# EAGLE schematic DP_current_measure_v1 (EAGLE 9.4.2)
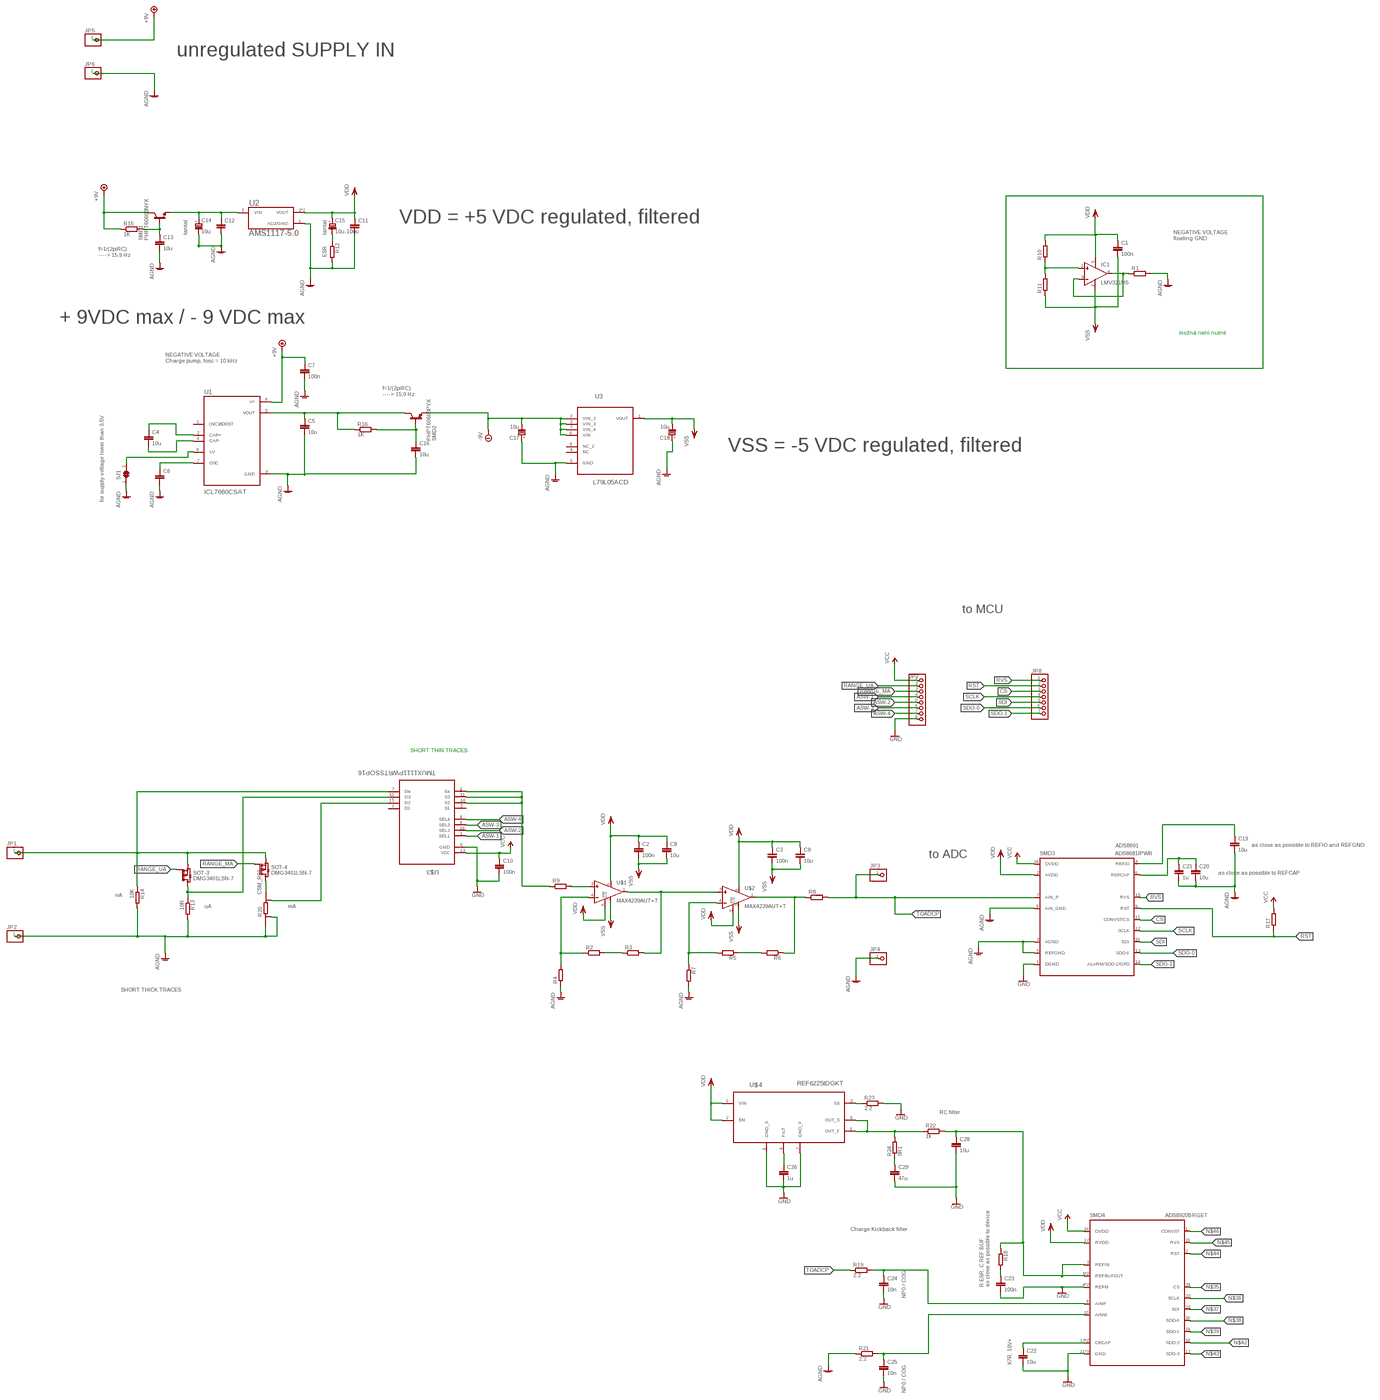
[diagram p0: schematic, sheet 1, overview]
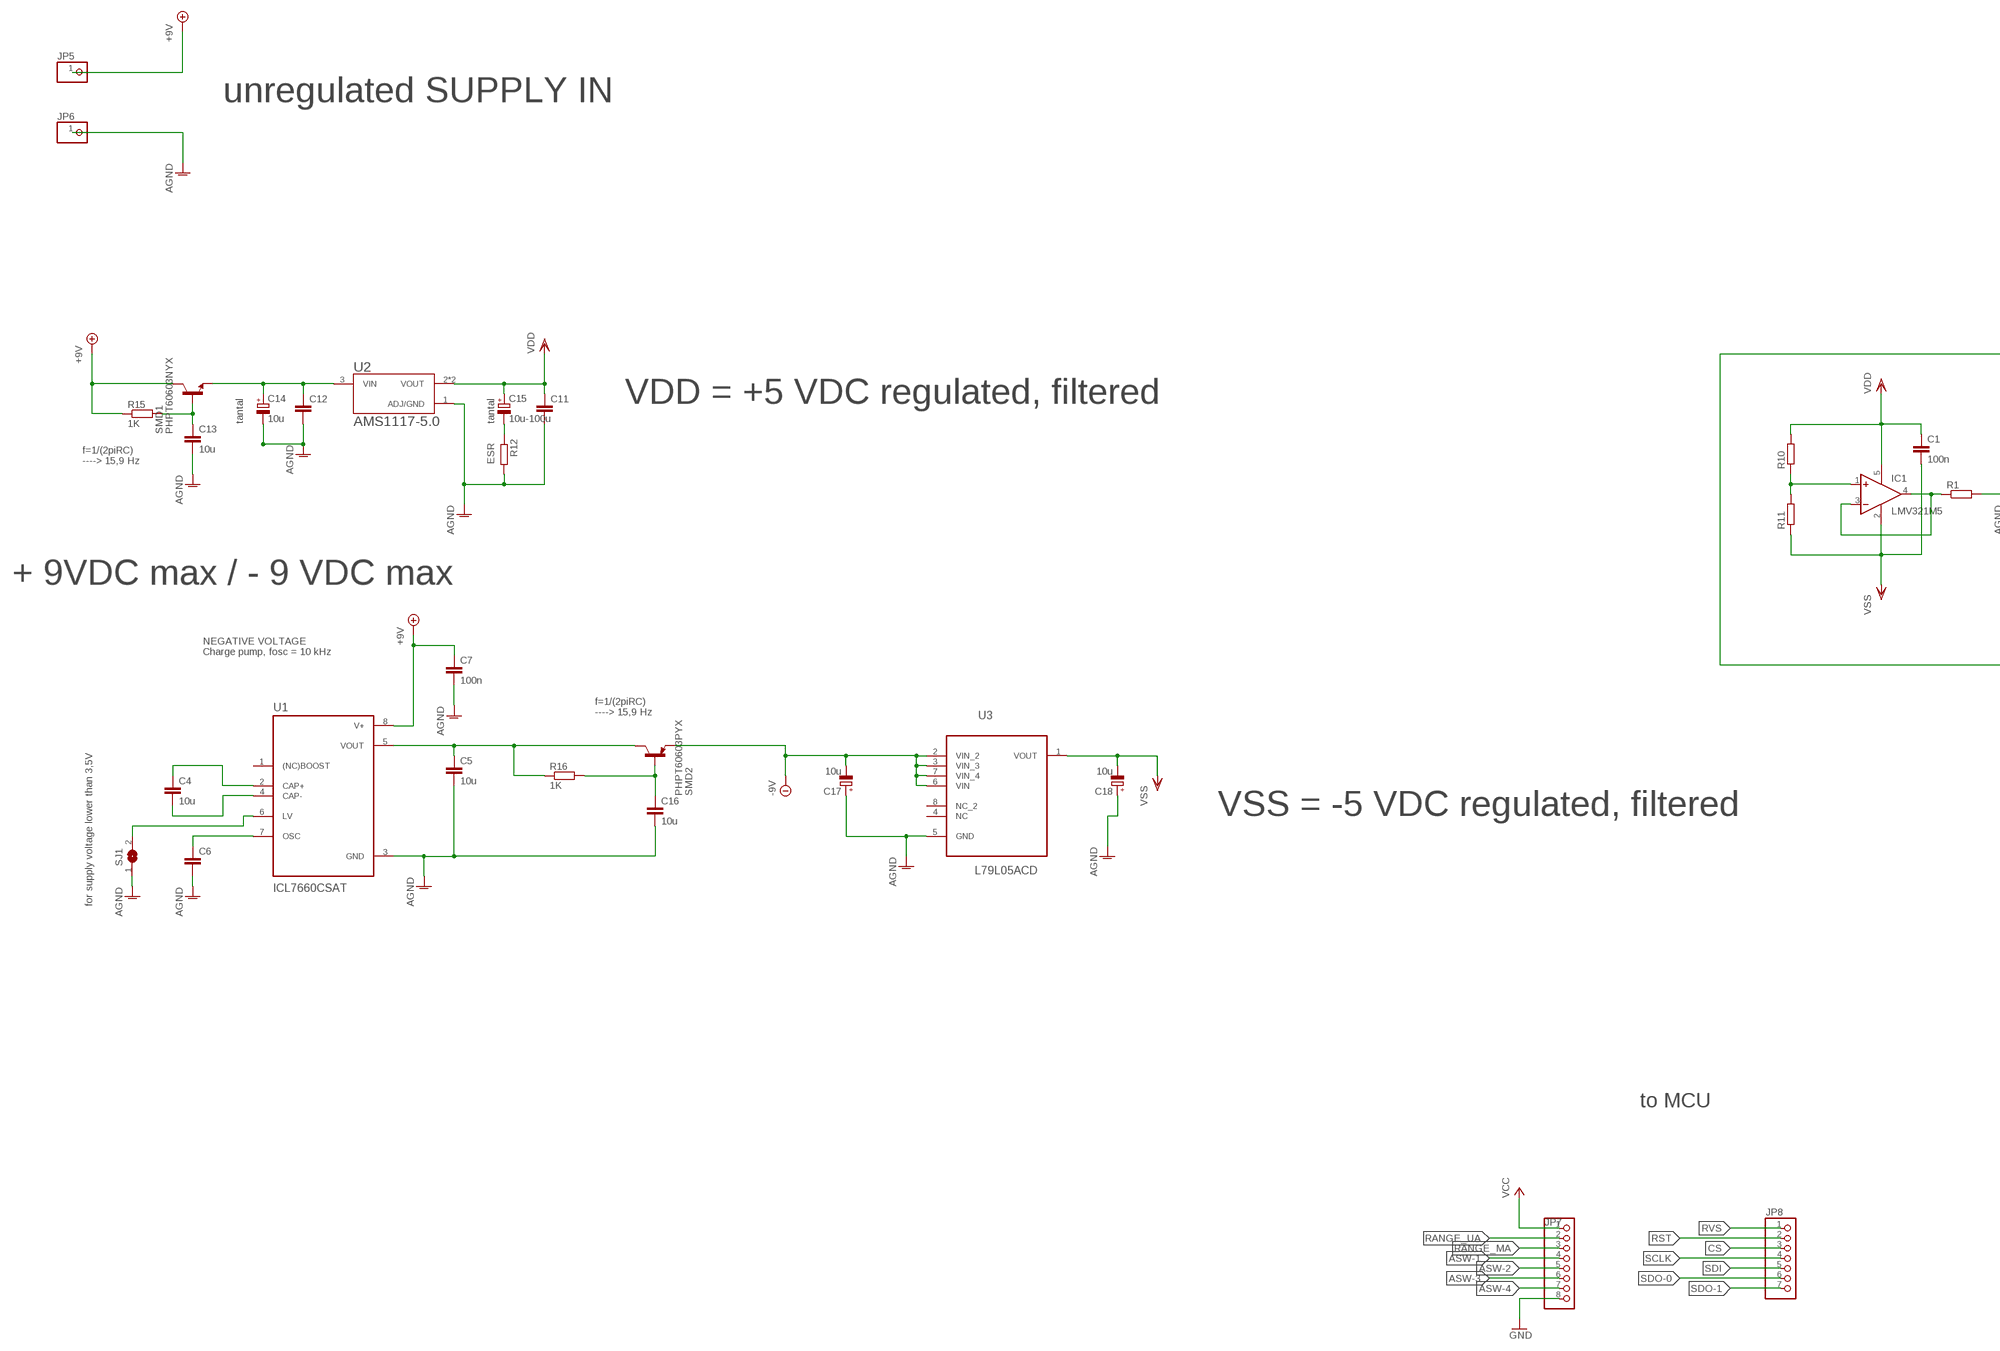
[diagram p1: schematic, sheet 1, part 1 of 4]
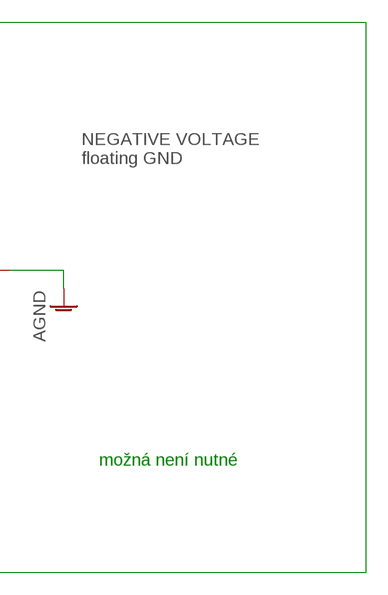
[diagram p2: schematic, sheet 1, part 2 of 4]
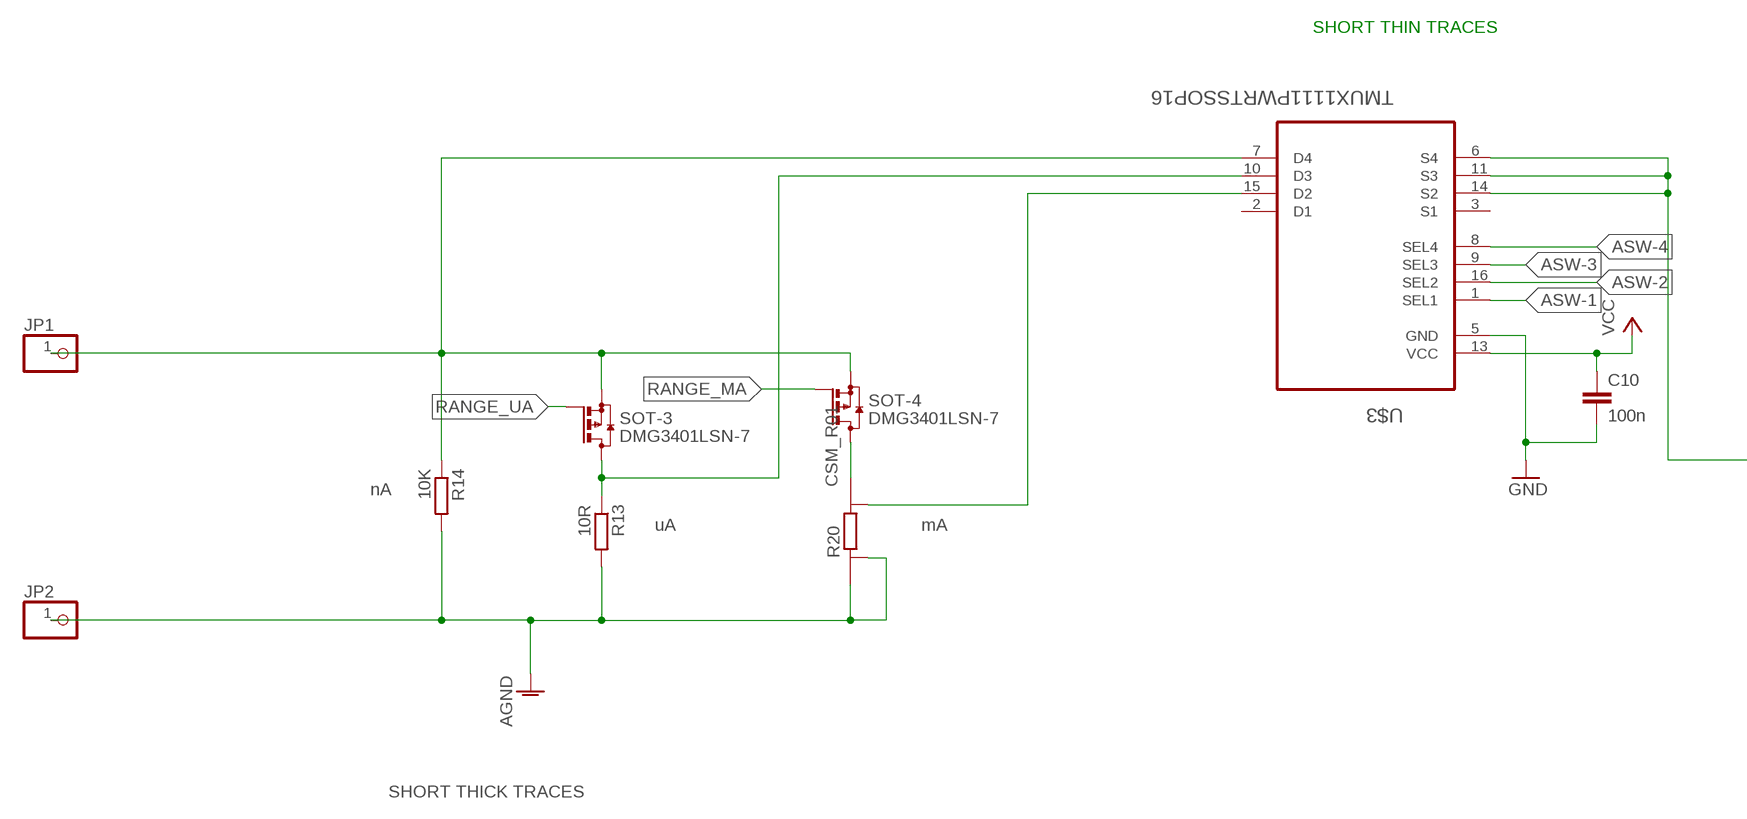
[diagram p3: schematic, sheet 1, part 3 of 4]
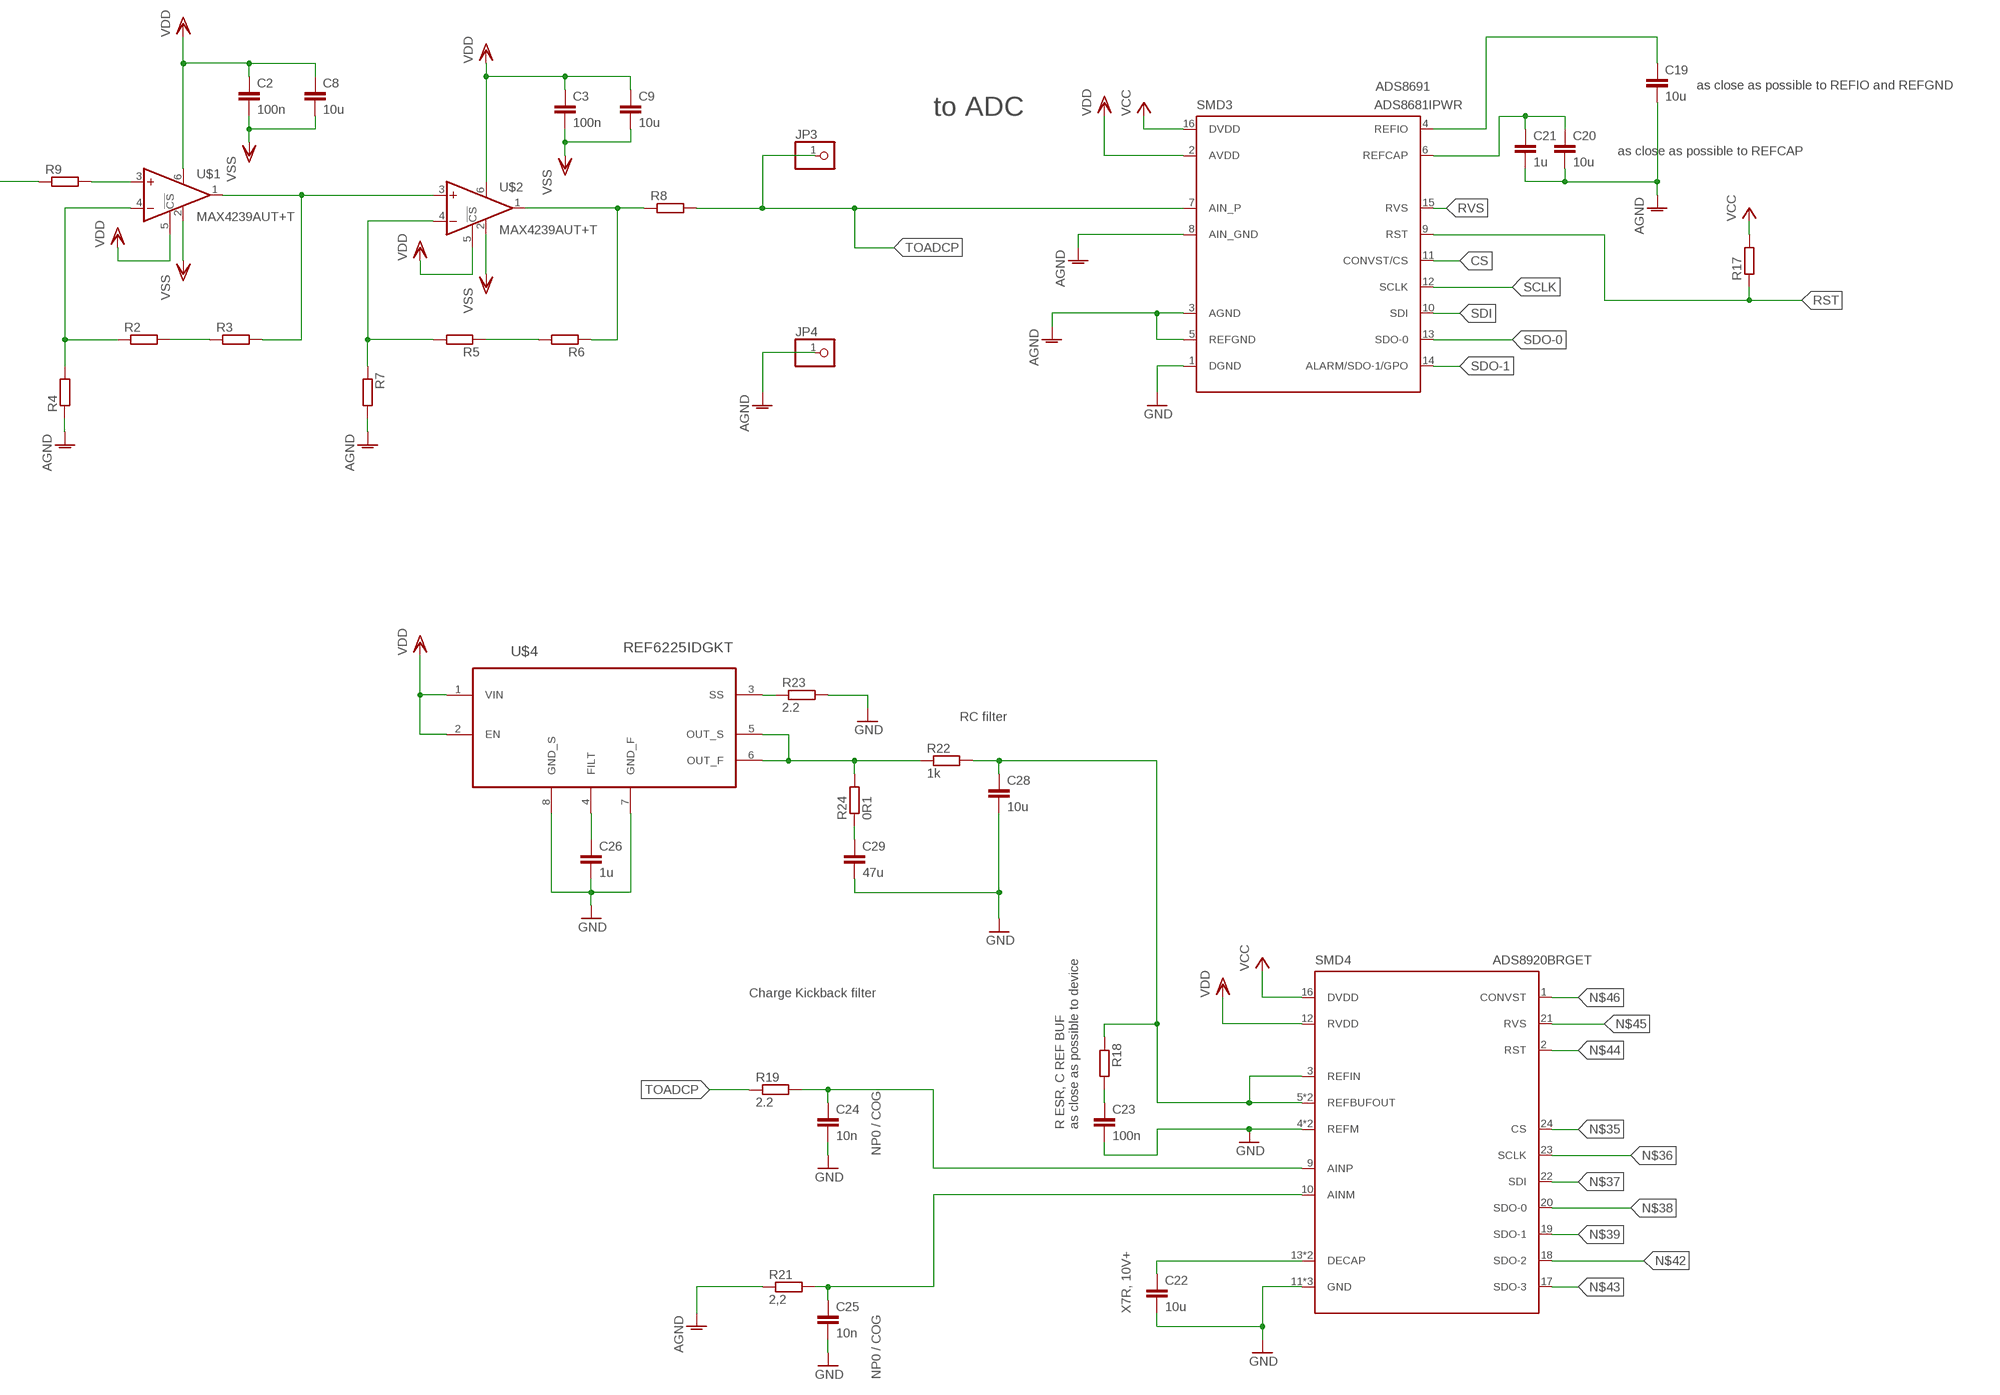
[diagram p4: schematic, sheet 1, part 4 of 4]

## Parts
C1  100n  C-EUC0805  [C0805]
C2  100n  C-EUC0805  [C0805]
C3  100n  C-EUC0805  [C0805]
C4  10u  C-EUC1206  [C1206]
C5  10u  C-EUC1206  [C1206]
C6  C-EUC1206  [C1206]
C7  100n  C-EUC0805  [C0805]
C8  10u  C-EUC1206  [C1206]
C9  10u  C-EUC1206  [C1206]
C10  100n  C-EUC0805  [C0805]
C11  C-EUC1206  [C1206]
C12  C-EUC1206  [C1206]
C13  10u  C-EUC1206  [C1206]
C14  10u  CPOL-EUSMCB  [SMC_B]
C15  10u-100u  CPOL-EUSMCB  [SMC_B]
C16  10u  C-EUC1206  [C1206]
C17  10u  CPOL-EUSMCB  [SMC_B]
C18  10u  CPOL-EUSMCB  [SMC_B]
C19  10u  C-EUC1206  [C1206]
C20  10u  C-EUC1206  [C1206]
C21  1u  C-EUC0805  [C0805]
C22  10u  C-EUC1206  [C1206]
C23  100n  C-EUC0805  [C0805]
C24  10n  C-EUC0805  [C0805]
C25  10n  C-EUC0805  [C0805]
C26  1u  C-EUC1206  [C1206]
C28  10u  C-EUC1206  [C1206]
C29  47u  C-EUC1206  [C1206]
IC1  LMV321M5  [SOT23-5]
JP1  PINHD-1X1  [1X01]
JP2  PINHD-1X1  [1X01]
JP3  PINHD-1X1  [1X01]
JP4  PINHD-1X1  [1X01]
JP5  PINHD-1X1  [1X01]
JP6  PINHD-1X1  [1X01]
JP7  PINHD-1X8  [1X08]
JP8  PINHD-1X7  [1X07]
R1  R-EU_R0805  [R0805]
R2  R-EU_R0805  [R0805]
R3  R-EU_R0805  [R0805]
R4  R-EU_R0805  [R0805]
R5  R-EU_R0805  [R0805]
R6  R-EU_R0805  [R0805]
R7  R-EU_R0805  [R0805]
R8  R-EU_R0805  [R0805]
R9  R-EU_R0805  [R0805]
R10  R-EU_R0805  [R0805]
R11  R-EU_R0805  [R0805]
R12  R-EU_R0805  [R0805]
R13  10R  R-EU_R0805  [R0805]
R14  10K  R-EU_R0805  [R0805]
R15  1K  R-EU_R0805  [R0805]
R16  1K  R-EU_R0805  [R0805]
R17  R-EU_R0805  [R0805]
R18  R-EU_R0805  [R0805]
R19  2.2  R-EU_R0805  [R0805]
R20  CSM_R01  [R2512]
R21  2,2  R-EU_R0805  [R0805]
R22  1k  R-EU_R0805  [R0805]
R23  2.2  R-EU_R0805  [R0805]
R24  0R1  R-EU_R0805  [R0805]
SJ1  SJ  [SJ]
SMD1  PHPT60603NYX  [TO127P600X120-5N]
SMD2  PHPT60603PYX  [TO127P600X120-5N]
SMD3  ADS8681IPWR  [SOP65P640X120-16N]
SMD4  ADS8920BRGET  [BQ24195RGER]
SOT-3  DMG3401LSN-7  [SOT23]
SOT-4  DMG3401LSN-7  [SOT23]
U1  ICL7660CSAT  [SOIC127P600X175-8N]
U2  AMS1117-5.0  [SOT229P700X180-4N]
U3  L79L05ACD  [SOIC127P600X175-8N]
U$1  MAX4239AUT+T  [SOT23-6]
U$2  MAX4239AUT+T  [SOT23-6]
U$3  TMUX1111PWRTSSOP16  [SOP65P640X110-16N]
U$4  REF6225IDGKT  [SOP65P640X120-16N]

## Nets
+9V: JP5.1
+12V: C7.1 R15.1 SMD1.5(C) U1.8(V+) ; supply symbol labelled +9V
-12V: C17.- SMD2.1(E) SMD2.2(E) SMD2.3(E) U3.2(VIN_2) U3.3(VIN_3) U3.6(VIN) U3.7(VIN_4) ; supply symbol labelled -9V
AGND: C5.2 C6.2 C7.2 C11.2 C12.2 C13.2 C14.- C16.2 C17.+ C18.+ C19.2 C20.2 C21.2 JP2.1 JP4.1 JP6.1 R1.2 R4.1 R7.2 R12.2 R13.2 R14.2 R20.E1 R20.I1 R21.1 SJ1.1 SMD3.3(AGND) SMD3.5(REFGND) SMD3.8(AIN_GND) U1.3(GND) U2.1(ADJ/GND) U3.5(GND)
ASW-1: JP7.4 U$3.1(SEL1)
ASW-2: JP7.5 U$3.16(SEL2)
ASW-3: JP7.6 U$3.9(SEL3)
ASW-4: JP7.7 U$3.8(SEL4)
CS: JP8.3 SMD3.11(CONVST/CS)
GND: C10.2 C22.2 C23.2 C24.2 C25.2 C26.2 C28.2 C29.2 JP7.8 R23.2 SMD3.1(DGND) SMD4.4(REFM) SMD4.8(REFM) SMD4.11(GND) SMD4.15(GND) SMD4.25(GND) U$3.5(GND) U$4.7(GND_F) U$4.8(GND_S)
N$1: R6.1 R8.1 U$2.1(OUT)
N$2: R5.1 R6.2
N$3: R5.2 R7.1 U$2.4(-IN)
N$4: R2.2 R3.1
N$5: R3.2 U$1.1(OUT) U$2.3(+IN)
N$6: R9.2 U$1.3(+IN)
N$7: R2.1 R4.2 U$1.4(-IN)
N$8: R13.1 SOT-3.3(D) U$3.10(D3)
N$9: IC1.3(-IN) IC1.4(OUT) R1.1
N$10: IC1.1(+IN) R10.1 R11.2
N$11: JP1.1 R14.1 SOT-3.2(S) SOT-4.2(S) U$3.7(D4)
N$13: R22.1 R24.2 U$4.5(OUT_S) U$4.6(OUT_F)
N$14: R20.E2 U$3.15(D2)
N$15: R9.1 U$3.6(S4) U$3.11(S3) U$3.14(S2)
N$16: C4.2 U1.4(CAP-)
N$17: R20.I2 SOT-4.3(D)
N$18: C4.1 U1.2(CAP+)
N$19: C6.1 U1.7(OSC)
N$20: C15.- R12.1
N$21: SJ1.2 U1.6(LV)
N$22: C12.1 C14.+ SMD1.1(E) SMD1.2(E) SMD1.3(E) U2.3(VIN)
N$23: C13.1 R15.2 SMD1.4(B)
N$24: C5.1 R16.1 SMD2.5(C) U1.5(VOUT)
N$25: C16.1 R16.2 SMD2.4(B)
N$26: C23.1 R18.2
N$27: C24.1 R19.2 SMD4.9(AINP)
N$28: C28.1 R18.1 R22.2 SMD4.3(REFIN) SMD4.5(REFBUFOUT) SMD4.7(REFBUFOUT)
N$29: C29.1 R24.1
N$30: C26.1 U$4.4(FILT)
N$32: C25.1 R21.2 SMD4.10(AINM)
N$33: C22.1 SMD4.13(DECAP) SMD4.14(DECAP)
N$34: R23.1 U$4.3(SS)
N$35: SMD4.24(CS)
N$36: SMD4.23(SCLK)
N$37: SMD4.22(SDI)
N$38: SMD4.20(SDO-0)
N$39: SMD4.19(SDO-1)
N$40: C20.1 C21.1 SMD3.6(REFCAP)
N$41: C19.1 SMD3.4(REFIO)
N$42: SMD4.18(SDO-2)
N$43: SMD4.17(SDO-3)
N$44: SMD4.2(RST)
N$45: SMD4.21(RVS)
N$46: SMD4.1(CONVST)
RANGE_MA: JP7.3 SOT-4.1(G)
RANGE_UA: JP7.2 SOT-3.1(G)
RST: JP8.2 R17.1 SMD3.9(RST)
RVS: JP8.1 SMD3.15(RVS)
SCLK: JP8.4 SMD3.12(SCLK)
SDI: JP8.5 SMD3.10(SDI)
SDO-0: JP8.6 SMD3.13(SDO-0)
SDO-1: JP8.7 SMD3.14(ALARM/SDO-1/GPO)
TOADCP: JP3.1 R8.2 R19.1 SMD3.7(AIN_P)
VCC: C10.1 JP7.1 R17.2 SMD3.16(DVDD) SMD4.16(DVDD) U$3.13(VCC)
VDD: C1.1 C2.1 C3.1 C8.1 C9.1 C11.1 C15.+ IC1.5(V+) R10.2 SMD3.2(AVDD) SMD4.12(RVDD) U2.2(VOUT) U2.4(VOUT) U$1.5(!CS) U$1.6(V+) U$2.5(!CS) U$2.6(V+) U$4.1(VIN) U$4.2(EN)
VSS: C1.2 C2.2 C3.2 C8.2 C9.2 C18.- IC1.2(V-) R11.1 U3.1(VOUT) U$1.2(V-) U$2.2(V-)
Unconnected: U1.1((NC)BOOST) U3.4(NC) U3.8(NC_2) U$3.2(D1) U$3.3(S1)

## Notes on the sheet
- unregulated SUPPLY IN
- VDD = +5 VDC regulated, filtered
- tantal | tantal
- NEGATIVE VOLTAGE
  floating GND
- f=1/(2piRC) 
  ----> 15,9 Hz
- ESR
- + 9VDC max / - 9 VDC max
- možná není nutné
- NEGATIVE VOLTAGE
  Charge pump, fosc = 10 kHz
- f=1/(2piRC) 
  ----> 15,9 Hz
- VSS = -5 VDC regulated, filtered
- for supply voltage lower than 3,5V
- to MCU
- SHORT THIN TRACES
- ADS8691 | as close as possible to REFIO and REFGND
- to ADC
- as close as possible to REFCAP
- nA
- uA | mA
- SHORT THICK TRACES
- RC filter
- Charge Kickback filter
- R ESR, C REF BUF
  as close as possible to device
- NP0 / COG
- X7R, 10V+
- NP0 / COG

## Library data of the parts
C1-C13 C16 C19-C26 C28 C29 = rcl:C-EU: CAPACITOR, European symbol; SPICEPREFIX: C
C14 C15 C17 C18 = rcl:CPOL-EU: POLARIZED CAPACITOR, European symbol; SPICEPREFIX: C
IC1 = linear:LMV321?*: General Purpose, Low Voltage, Rail-to-Rail Output Operational Amplifiers Source: http://www.national.com/mpf/LM/LMV321.html http://www.national.com/dt/lmv_qual.pdf
JP1-JP6 = pinhead:PINHD-1X1: PIN HEADER
JP7 = pinhead:PINHD-1X8: PIN HEADER
JP8 = pinhead:PINHD-1X7: PIN HEADER
R1-R19 R21-R24 = rcl:R-EU_: RESISTOR, European symbol; SPICEPREFIX: R
R20 = RLC_special:CSM_R01
SJ1 = jumper:SJ: SMD solder JUMPER
SMD1 = BJT:PHPT60603NYX
SMD2 = BJT:PHPT60603PYX
SMD3 = ADC:ADS8681IPWR
SMD4 = ADC:ADS8920BRGET
SOT-3 SOT-4 = DMG_transistor:DMG3401LSN-7
U1 = ICL7660CSAT:ICL7660CSAT; AVAILABILITY: Unavailable; DESCRIPTION: DC-DC Switching Divider, Inverting, Regulator, Adjustable, 1.5 V-10 Vin, 3V-20Vout, 20mAout, SOIC-8; MF: Maxim Integrated; MP: ICL7660CSA+; PACKAGE: SOIC-8 Maxim; PRICE: None
U2 = AMS1117-5.0:AMS1117-5.0: Sot223/Pkg 1-Amp 5-Volt Low Drop Out Voltage Regulatator; AVAILABILITY: Unavailable; DESCRIPTION: Sot223/Pkg 1-Amp 5-Volt Low Drop Out Voltage Regulatator; MF: Advanced Monolithic Systems; MP: AMS1117-5.0; PACKAGE: None; PRICE: None
U3 = L79L05ACD:L79L05ACD: NEGATIVE VOLTAGE REGULATORS; AVAILABILITY: Unavailable; DESCRIPTION: IC, V REG -5.0V, SMD, 79L05, SO-8-8; Primary Input Voltage: -10V; Output Voltage Fixed: -5V; Dropout Voltage Vdo: 1.7...; MF: STMicroelectronics; MP: L79L05ACD; PACKAGE: SOIC-8 STMicroelectronics; PRICE: None
U$1 U$2 = SOT23-6:MAX4239AUT+T
U$3 = TMUX1111:TMUX1111PWR
U$4 = ADC:REF6225IDGKT